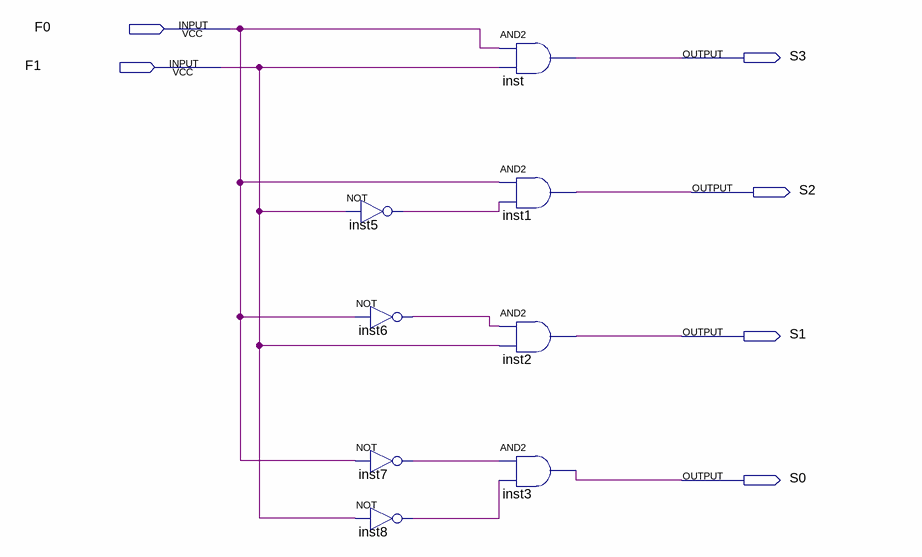
[diagram p0: schematic sheet]
// Quartus schematic DECODER_2T04.bdf as structural Verilog: 8 symbols, 6 pins
module DECODER_2T04 (
  input  F0,
  input  F1,
  output S3,
  output S2,
  output S1,
  output S0
);

  wire inst5_out, inst6_out, inst7_out, inst8_out;

  not inst5 (inst5_out, F1);
  not inst6 (inst6_out, F0);
  not inst7 (inst7_out, F0);
  not inst8 (inst8_out, F1);
  and inst (S3, F0, F1);
  and inst1 (S2, F0, inst5_out);
  and inst2 (S1, inst6_out, F1);
  and inst3 (S0, inst7_out, inst8_out);
endmodule
